# Altium schematic sheet Mounting_Holes.SchDoc
size Letter; Organization: Cegep Limoilou; Address1: 1300, 8e Avenue; Address2: Québec, QC; Address3: Canada; Address4: G1J 5L5; Revision: A; SheetNumber: 6; SheetTotal: 6; Conception: Thomas Lajoie; Titre: Trous de montage; Modification: TL
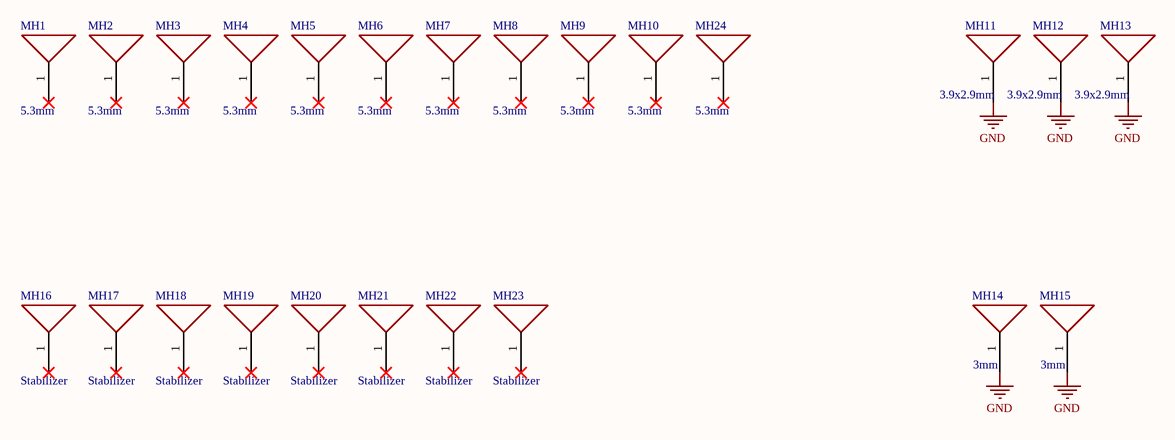
[diagram p0: Mounting_Holes.SchDoc]

## Parts
MH1  5.3mm  [MTH_ROUND_5.35D]
MH2  5.3mm  [MTH_ROUND_5.35D]
MH3  5.3mm  [MTH_ROUND_5.35D]
MH4  5.3mm  [MTH_ROUND_5.35D]
MH5  5.3mm  [MTH_ROUND_5.35D]
MH6  5.3mm  [MTH_ROUND_5.35D]
MH7  5.3mm  [MTH_ROUND_5.35D]
MH8  5.3mm  [MTH_ROUND_5.35D]
MH9  5.3mm  [MTH_ROUND_5.35D]
MH10  5.3mm  [MTH_ROUND_5.35D]
MH11  3.9x2.9mm  [MTH_OBLONG_3.9x2.9_PL]
MH12  3.9x2.9mm  [MTH_OBLONG_3.9x2.9_PL]
MH13  3.9x2.9mm  [MTH_OBLONG_3.9x2.9_PL]
MH14  3mm  [MTH_ROUND_3D_PL]
MH15  3mm  [MTH_ROUND_3D_PL]
MH16  Stabilizer  [STABILIZERS_HOLE]
MH17  Stabilizer  [STABILIZERS_HOLE]
MH18  Stabilizer  [STABILIZERS_HOLE]
MH19  Stabilizer  [STABILIZERS_HOLE]
MH20  Stabilizer  [STABILIZERS_HOLE]
MH21  Stabilizer  [STABILIZERS_HOLE]
MH22  Stabilizer  [STABILIZERS_HOLE]
MH23  Stabilizer  [STABILIZERS_HOLE]
MH24  5.3mm  [MTH_ROUND_5.35D]

## Nets
GND: MH11.1 MH12.1 MH13.1 MH14.1 MH15.1

Not connected (* = marked no-connect by the designer): MH1 1*; MH2 1*; MH3 1*; MH4 1*; MH5 1*; MH6 1*; MH7 1*; MH8 1*; MH9 1*; MH10 1*; MH16 1*; MH17 1*; MH18 1*; MH19 1*; MH20 1*; MH21 1*; MH22 1*; MH23 1*; MH24 1*

## Notes on the sheet
- Titre :
- Conception :
- Date :
- Modification :
- Heure :
- Révision :
- Feuille
- de
- Fichier :

## Library data of the parts
MH1-MH24 = Mounting Hole